# Altium schematic sheet OCB.SchDoc
size A; SheetNumber: 1; SheetTotal: 1
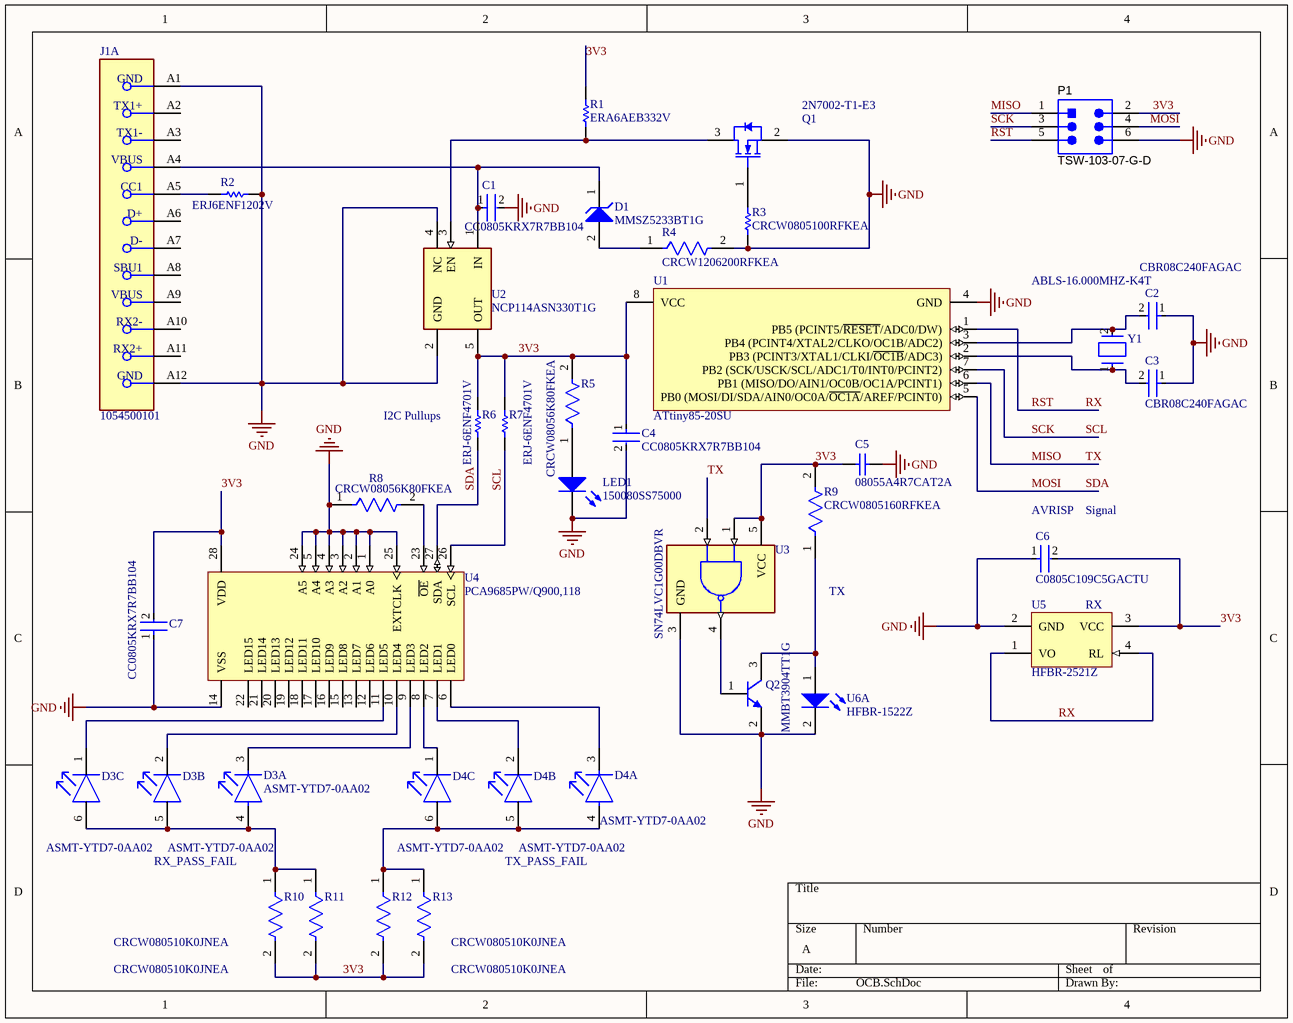
[diagram p0: OCB.SchDoc]

## Parts
C1  CC0805KRX7R7BB104  [FP-CC0805-0_85-MFG]
C2  CBR08C240FAGAC  [FP-CBR08C-MFG]
C3  CBR08C240FAGAC  [FP-CBR08C-MFG]
C4  CC0805KRX7R7BB104  [FP-CC0805-0_85-MFG]
C5  08055A4R7CAT2A  [CAPC2013X71X50ML20T25]
C6  C0805C109C5GACTU  [FP-C0805C-DN-MFG]
C7  CC0805KRX7R7BB104  [FP-CC0805-0_85-MFG]
D1  MMSZ5233BT1G  [ONSC-SOD-123-2-425-04_V]
D3  ASMT-YTD7-0AA02  [FP-PLCC-6-MFG]  (parts A,B,C of 3)
D4  ASMT-YTD7-0AA02  [FP-PLCC-6-MFG]  (parts A,B,C of 3)
J1  1054500101  [FP-1054500101-MFG]  (part A of 3)
LED1  150080SS75000  [0805_A]
P1  TSW-103-07-G-D  [SMTC-TSW-103-07-G-D_V]
Q1  2N7002-T1-E3  [VISH-TO-236-3_A_L]
Q2  MMBT3904TT1G  [ONSC-SC-75-3-463-01_V]
R1  ERA6AEB332V  [RESC2013X60X40NL20T25]
R2  ERJ6ENF1202V  [RESC2013X70X40ML20T20]
R3  CRCW0805100RFKEA  [RESC2013X50X30LL20T20]
R4  CRCW1206200RFKEA  [FP-CRCW1206-e3-IPC_C]
R5  CRCW08056K80FKEA  [FP-CRCW0805-e3-IPC_A]
R6  ERJ-6ENF4701V  [RESC2013X70X40NL20T20]
R7  ERJ-6ENF4701V  [RESC2013X70X40NL20T20]
R8  CRCW08056K80FKEA  [FP-CRCW0805-e3-IPC_A]
R9  CRCW0805160RFKEA  [FP-CRCW0805-e3-IPC_C]
R10  CRCW080510K0JNEA  [FP-CRCW0805-e3-IPC_C]
R11  CRCW080510K0JNEA  [FP-CRCW0805-e3-IPC_C]
R12  CRCW080510K0JNEA  [FP-CRCW0805-e3-IPC_C]
R13  CRCW080510K0JNEA  [FP-CRCW0805-e3-IPC_C]
U1  ATtiny85-20SU  [8S2_M]
U2  NCP114ASN330T1G  [FP-483-MFG]
U3  SN74LVC1G00DBVR  [FP-DBV0005A-MFG]
U4  PCA9685PW/Q900,118  [SOT361-1_V]
U5  HFBR-2521Z  [BCM-HFBR-2521Z-4]
U6  HFBR-1522Z  [AVAG-HFBR-15X2Z_V]  (part A of 2)
Y1  ABLS-16.000MHZ-K4T  [FP-ABLS-MFG]

## Nets
GND: C1.2 C2.1 C3.1 C4.2 C5.1 C6.1 C7.1 J1.A1(GND) J1.A12(GND) LED1.1(K) P1.6 Q1.2(S) Q2.2(E) R2.2 R3.1 R4.2 R8.1 U1.4(GND) U2.2(GND) U2.4(NC) U3.3(GND) U4.1(A0) U4.2(A1) U4.3(A2) U4.4(A3) U4.5(A4) U4.14(VSS) U4.24(A5) U4.25(EXTCLK) U5.2(GND) U6.2(CATHODE)
3V3: C4.1 C5.2 C6.2 C7.2 P1.2 R1.2 R5.2 R6.2 R7.2 R9.2 R10.2 R11.2 R12.2 R13.2 U1.8(VCC) U2.5(OUT) U3.1(A) U3.5(VCC) U4.28(VDD) U5.3(VCC)
MISO: P1.1 U1.6(PB1_(MISO/DO/AIN1/OC0B/OC1A/PCINT1)) U3.2(B)  [also labelled TX]
MOSI: P1.4 R6.1 U1.5(PB0_(MOSI/DI/SDA/AIN0/OC0A/~{OC1A}/AREF/PCINT0)) U4.27(SDA)  [also labelled SDA]
RST: P1.5 U1.1(PB5_(PCINT5/~{RESET}/ADC0/DW)) U5.1(VO) U5.4(RL)  [also labelled RX]
SCK: P1.3 R7.1 U1.7(PB2_(SCK/USCK/SCL/ADC1/T0/INT0/PCINT2)) U4.26(SCL)  [also labelled SCL]
NetC1_1: C1.1 D1.1(K) J1.A4(VBUS) U2.1(IN)
NetC2_2: C2.2 U1.3(PB4_(PCINT4/XTAL2/CLKO/OC1B/ADC2)) Y1.2
NetC3_2: C3.2 U1.2(PB3_(PCINT3/XTAL1/CLKI/~{OC1B}/ADC3)) Y1.1
NetD1_2: D1.2(A) R4.1
NetD3_1: D3.1(Cathode(Blue)) U4.11(LED5)
NetD3_2: D3.2(Cathode(Green)) U4.10(LED4)
NetD3_3: D3.3(Cathode(Red)) U4.9(LED3)
NetD3_4: D3.4(Anode(Red)) D3.5(Anode(Green)) D3.6(Anode(Blue)) R10.1 R11.1
NetD4_1: D4.1(Cathode(Blue)) U4.8(LED2)
NetD4_2: D4.2(Cathode(Green)) U4.7(LED1)
NetD4_3: D4.3(Cathode(Red)) U4.6(LED0)
NetD4_4: D4.4(Anode(Red)) D4.5(Anode(Green)) D4.6(Anode(Blue)) R12.1 R13.1
NetJ1_A5: J1.A5(CC1) R2.1
NetLED1_2: LED1.2(A) R5.1
NetQ1_1: Q1.1(G) R3.2
NetQ1_3: Q1.3(D) R1.1 U2.3(EN)
NetQ2_1: Q2.1(B) U3.4(Y)
NetQ2_3: Q2.3(C) R9.1 U6.1(ANODE)
NetR8_2: R8.2 U4.23(~{OE})

Not connected (* = marked no-connect by the designer): J1 A2(TX1+) A3(TX1-) A6(D+) A7(D-) A8(SBU1) A9(VBUS) A10(RX2-) A11(RX2+); U4 12(LED6) 13(LED7) 15(LED8) 16(LED9) 17(LED10) 18(LED11) 19(LED12) 20(LED13) 21(LED14) 22(LED15)

## Notes on the sheet
- (near R6) I2C Pullups
- (near C6) AVRISP
- (near C6) Signal
- TX
- (near U5) RX
- RX_PASS_FAIL
- TX_PASS_FAIL

## Library data of the parts
C1 C4 C7 = CMP-1036-04402-6: CAP CER 0.1UF 16V X7R 0805; Manufacturer: Yageo; Material: Ceramic; Tolerance: 0.1; Capacitance: 100 nF; Value: 100 nF; Manufacturer Part Number: CC0805KRX7R7BB104; Temperature: -30°C to +85°C; Lead Free: Yes; Footprint Url: http://www.yageo.com/exep/pages/download/literatures/UPY-C_GEN_24.pdf; Voltage Rating: 16 V; Package: CC0805-0.85; RoHS: TRUE; Digikey Description: CAP CER 0.1UF 16V X7R 0805; Category: Cap; Octopart: https://octopart.com/cc0805krx7r7bb104-yageo-39467769; Device Class L3: Ceramic Capacitors; ComponentLink2URL: http://www.yageo.com/documents/recent/UPY-GPHC_Y5V_6.3V-to-50V_8.pdf; Temperature Range Low: -30°C; Mouser Description: Multilayer Ceramic Capacitors MLCC - SMD/SMT 100nF 16V X7R 10%; Automotive: No; Device Class L2: Capacitors; Height: 0.95mm; ComponentLink2Description: Datasheet; Temperature Characteristic: X7R; Ipc Land Pattern Name: CAPC200125X85; Device Class L1: Passive Components; Temperature Range High: +85°C
C2 C3 = CMP-03020-025790-1: CAP CER 24PF 250V C0G/NP0 0805; Manufacturer: KEMET; Material: Ceramic; Description: CBR0805 24 pF C0G 30ppm/°C 1.00% 250 V; Temperature Characteristic: C0G; Tolerance: 0.01; Temperature Coefficient: 30ppm/°C; Ipc Land Pattern Name: CAPC200125X85; Device Class L1: Passive Components; Manufacturer Part Number: CBR08C240FAGAC; Temperature Range High: +125°C; ComponentLink2Description: Datasheet; Package: CBR08C; Device Class L2: Capacitors; Octopart: https://octopart.com/cbr08c240fagac-kemet-23843296; RoHS: TRUE; Lead Free: Yes; Voltage Rating: 250 V; Automotive: No; Height: 0.95mm; Category: Cap; Digikey Description: CAP CER 24PF 250V C0G/NP0 0805; Device Class L3: Ceramic Capacitors; Value: 24 pF; Capacitance: 24 pF; ComponentLink2URL: https://content.kemet.com/datasheets/KEM_C1030_CBR_SMD.pdf; Temperature Range Low: -55°C; Temperature: -55°C to +125°C
C5 = CMP-1036-00549-2: Manufacturer: AVX Interconnect / Elco; Part Number: 08055A4R7CAT2A
C6 = CMP-2007-00453-2: CAP CER 1PF 50V C0G/NP0 0805; Manufacturer: KEMET; Value: 1.0 pF; Temperature Characteristic: C0G; Material: Ceramic; Tolerance: 0.25 pF; Temperature Coefficient: 30ppm/°C; Manufacturer Part Number: C0805C109C5GACTU; Voltage Rating: 50 V; Device Class L2: Capacitors; Ipc Land Pattern Name: CAPC200125X78; Device Class L3: Ceramic Capacitors; Lead Free: Yes; ComponentLink2Description: Datasheet; Digikey Description: CAP CER 1PF 50V C0G/NP0 0805; Temperature Range High: +125°C; Temperature: -55°C to +125°C; Temperature Range Low: -55°C; Package: C0805C-DN; ComponentLink2URL: https://content.kemet.com/datasheets/KEM_C1003_C0G_SMD.pdf; Height: 0.88mm; Automotive: No; Mouser Description: Multilayer Ceramic Capacitors MLCC - SMD/SMT 50volts 1.0pF C0G 0.25%; Category: Cap; Octopart: https://octopart.com/c0805c109c5gactu-kemet-130858; Capacitance: 1.0 pF; RoHS: TRUE; Device Class L1: Passive Components
D1 = CMP-1060-00590-1: Zener Voltage Regulator, 500 mW, 2-Pin SOD-123, Pb-Free, Tape and Reel; Manufacturer: On Semiconductor; VZ Typ (V): 6.0; P Max (W): 0.5; PackageReference: SOD-123-2-425-04; ComponentLink3URL: http://www.onsemi.com/pub_link/Collateral/425-04.PDF; DatasheetVersion: Rev. 12; PackageDescription: 2-Pin SOD, Body 1.6 x 2.69 mm; ComponentLink2URL: http://www.onsemi.com/pub_link/Collateral/MMSZ5221BT1-D.PDF; ComponentLink1URL: http://www.onsemi.com/; Mounting Technology: Surface Mount; PartNumber: MMSZ5233BT1G; ComponentLink3Description: Package Specification; ComponentLink2Description: Datasheet; ComponentLink1Description: Manufacturer URL; RoHS: Pb-Free; Packing: Tape and Reel; PackageVersion: Rev. G, 10/2009
D3 D4 = CMP-18399-000005-1: LED RGB DIFFUSED 6PLCC SMD; Manufacturer: Broadcom; Power Dissipation: 125/90/90mW; Colour: Red, Green, Blue; Led Orientation: Top View; Max Junction Temp: +110°C; Forward Current: 20mA; Wavelength: 623/529/469nm; Viewing Angle: 120°; Forward Voltage: 2.1/3.1/3.1V; Reverse Voltage: 4V; Luminous Intensity: 650/1900/384mcd; Peak Emmision Wavelength: 630/522/465nm; Height: 2mm; Temperature: -40°C to +100°C; ComponentLink2URL: https://docs.broadcom.com/doc/AV02-3873EN; Temperature Range High: +100°C; RoHS: TRUE; Device Class L3: unset; ComponentLink2Description: Datasheet; Automotive: No; Temperature Range Low: -40°C; Device Class L1: Optoelectronics; Manufacturer Part Number: ASMT-YTD7-0AA02; Octopart: https://octopart.com/asmt-ytd7-0aa02-broadcom-71127359; Category: Diode; Package: PLCC-6; Lead Free: Yes; Device Class L2: LEDs; Digikey Description: LED RGB DIFFUSED 6PLCC SMD; Mouser Description: Standard LEDs - SMD PLCC6,T/MT SILICONE RGB
J1 = CMP-04767-000004-1: CONN RCP USB3.1 TYPEC 24P SMD RA; Manufacturer: Molex; Number Of Contacts: 24; Voltage Rating: 30V; Shielding: true; Is Female: yes; Current Rating: 0.25/1.25/5A; Pitch: 0.5mm; Conn Orientation: Right Angle; Package: 0; Height: 3.44mm; Footprint Url: https://www.molex.com/pdm_docs/sd/1054500101_sd.pdf; Device Class L1: Connectors; Category: Conn; Device Class L2: USB Connectors; Digikey Description: CONN RCP USB3.1 TYPEC 24P SMD RA; Contact Material: Gold,Nickel; Mouser Description: USB Shielded I/O Receptacle; Type C; Right Angle; Surface Mount; Gold over Nickel; ComponentLink2Description: Datasheet; Lead Free: Yes; Automotive: No; Temperature Range High: +85°C; RoHS: TRUE; Octopart: https://octopart.com/105450-0101-molex-68082325; ComponentLink2URL: https://www.molex.com/webdocs/datasheets/pdf/en-us/1054500101_IO_CONNECTORS.pdf; Temperature: -30°C to +85°C; Usb Standard: USB 3.1; Temperature Range Low: -30°C; Device Class L3: unset; Manufacturer Part Number: 1054500101
LED1 = CMP-1426-00010-1: SMD mono-color Chip LED, WL-SMCW, Super Red; Manufacturer: Wuerth Elektronik; PackageReference: 0805_A; ComponentLink2URL: http://katalog.we-online.com/led/datasheet/150080SS75000.pdf; ComponentLink1URL: http://www.we-online.com; Color: Super Red; ComponentLink2Description: Datasheet; ComponentLink1Description: Manufacturer URL; PartNumber: 150080SS75000
P1 = CMP-2000-07329-1: Through Hole Header, Pitch 2.54 mm, 2 x 3 Position, Height 8.58 mm, Tail Length 2.54 mm, -55 to 125 degC, RoHS, Bulk; Manufacturer: Samtec-Inc.; Number of Positions Loaded: All; Number of Positions: 6; Row Spacing: 0.100"(2.54mm); Connector Type: Header,Unshrouded; Package Reference: TSW-103-07-G-D; Termination: Solder; Manufacturer URL: http://www.samtec.com/; Contact Finish: Gold; Contact Mating Length: 0.230"(5.84mm); Package Description: Through Hole Header, Pitch 2.54 mm, 2 x 3 Position, Height 8.58 mm, Tail Length 2.54 mm; Datasheet Version: 12/2015; Number of Rows: 2; Features: -; Family: RectangularConnectors-Headers,MalePins; Fastening Type: -; Datasheet URL: http://suddendocs.samtec.com/catalog_english/tsw_th.pdf; Category: Connectors,Interconnects; Package URL: http://suddendocs.samtec.com/prints/tsw-xxx-xx-xxx-x-xx-xxx-mkt.pdf; Mounting Type: ThroughHole; Contact Finish Thickness: 10µin(0.25µm); Packaging: Bulk; Color: Black; Pitch: 0.100"(2.54mm); Series: TSW; Contact Type: MalePin; Mounting Technology: ThroughHole
Q1 = CMP-2000-05565-1: N-Channel MOSFET, 115 mA, 60 V, -55 to 150 degC, 3-Pin SOT23, RoHS, Tape and Reel; Manufacturer: Vishay; Continuous Drain Current Id: 115mA; Threshold Voltage Vgs: 2.1V; Transistor Case Style: TO-236; On Resistance Rds(on): 7.5ohm; Transistor Polarity: NChannel; Power Dissipation Pd: 200mW; No. of Pins: 3; SVHC: NoSVHC(17-Dec-2014); Drain Source Voltage Vds: 60V; Rds(on) Test Voltage Vgs: 10V; Package URL: http://www.vishay.com/docs/71196/71196.pdf; Package Description: 3-Pin Small Outline Transistor, Body 2.92 x 1.3 mm, Pitch 0.95 mm; Datasheet URL: http://www.vishay.com/docs/70226/70226.pdf; Package Reference: TO-236-3; MSL: MSL1-Unlimited; Mounting Technology: SurfaceMount; Operating Temperature Max: 150°C; Datasheet Version: Rev. F, 07/2001; Manufacturer URL: http://www.vishay.com/
Q2 = CMP-1048-00420-1: General Purpose Transistor, NPN Silicon, 3-Pin SC-75, Pb-Free, Tape and Reel; Manufacturer: On Semiconductor; IC Continuous (A): 0.2; fT Min (MHz): 300; ComponentLink3URL: http://www.onsemi.com/pub_link/Collateral/463-01.PDF; DatasheetVersion: Rev. 5; RoHS: TRUE; Mounting Technology: Surface Mount; ComponentLink1URL: http://www.onsemi.com/; ComponentLink3Description: Package Specification; PackageReference: SC-75-3-463-01; Polarity: NPN; ComponentLink2Description: Datasheet; PackageVersion: Rev. F, 07/2005; PartNumber: MMBT3904TT1G; ComponentLink2URL: http://www.onsemi.cn/pub_link/Collateral/MMBT3904TT1-D.PDF; ComponentLink1Description: Manufacturer URL; PackageDescription: 3-Pin Small Outline Transistor, Body 1.6 x 0.8 mm, Pitch 0.5 mm; Packing: Tape and Reel
R1 = CMP-2001-00629-1: Manufacturer: Panasonic; Part Number: ERA6AEB332V
R2 = CMP-2001-00513-1: Manufacturer: Panasonic; Part Number: ERJ6ENF1202V
R3 = CMP-2001-04901-1: Manufacturer: Vishay Dale; Part Number: CRCW0805100RFKEA
R4 = CMP-2003-01935-2: RES Thick Film, 200Ω, 1%, 0.25W, 100ppm/°C, 1206; Max Power Dissipation: 250mW; Voltage Rating (DC): 200V; Resistance: 200R; Min Operating Temperature: -55°C; Length: 3.2mm; Composition: Thick Film; Number of Terminations: 2; Power Rating: 250mW; Temperature Coefficient: 100ppm/°C; Lead Free: Lead Free; Voltage Rating: 200V; Case Code (Metric): 3216; Features: Automotive AEC-Q200; Max Operating Temperature: 155°C; Height: 0.55mm; Case/Package: 1206; Contact Plating: Tin; Package Quantity: 10; Width: 1.6mm; Military Standard: Not; Number of Pins: 2; Weight: 0.000353oz; Working Voltage: 200V; Packaging: Tape and Reel; Depth: 1.6mm; Case Code (Imperial): 1206; Termination: SMD/SMT; Radiation Hardening: No; Tolerance: 1%
R5 R8 = CMP-2001-04088-2: RES Thick Film, 6.8kΩ, 1%, 0.125W, 100ppm/°C, 0805; Resistance: 6.8kR; Voltage Rating: 150V; Max Power Dissipation: 125mW; Termination: SMD/SMT; Number of Terminations: 2; Radiation Hardening: No; Lead Free: Lead Free; Features: Automotive AEC-Q200; Case Code (Metric): 2012; Contact Plating: Tin; Temperature Coefficient: 100ppm/°C; Tolerance: 1%; Min Operating Temperature: -55°C; Width: 0.049inch; Mount: Surface Mount; Weight: 0.000194oz; Max Operating Temperature: 155°C; Case Code (Imperial): 0805; Military Standard: Not; Depth: 1.25mm; Length: 2mm; Height: 0.45mm; Voltage Rating (DC): 150V; Case/Package: 0805; Package Quantity: 10; Packaging: Tape and Reel; Composition: Thick Film; Power Rating: 125mW
R6 R7 = CMP-2001-00550-5: Chip Resistor, 4.7 KOhm, +/- 1%, 0.125 W, -55 to 155 degC, 0805 (2012 Metric), RoHS, Tape and Reel; Manufacturer: Panasonic; Voltage Rating: 150 V; Min Operating Temperature: -55 degC; PackageReference: 0805; Mounting Technology: Surface Mount; Height: 0.6 mm; PackageDescription: 2-Pin Surface Mount Device, Body 2 x 1.25 mm; RoHSCompliant: true; Length: 2 mm; REACH SVHC: Yes; Packaging: Tape and Reel; Pins: 2; Mount: Surface Mount; ComponentLink2Description: Datasheet; ComponentLink1URL: http://www.panasonic.com/; ComponentLink1Description: Manufacturer URL; DatasheetVersion: 04/2015; Package Quantity: 5000; ComponentLink2URL: http://industrial.panasonic.com/cdbs/www-data/pdf/RDA0000/AOA0000C86.pdf; Max Operating Temperature: 155 degC
R9 = CMP-1013-00418-2: RES Thick Film, 160Ω, 1%, 0.125W, 100ppm/°C, 0805; Voltage Rating (DC): 150V; Max Power Dissipation: 125mW; Resistance: 160R; Termination: SMD/SMT; Min Operating Temperature: -55°C; Number of Terminations: 2; Number of Pins: 2; Composition: Thick Film; Voltage Rating: 150V; Length: 2mm; Tolerance: 1%; Case Code (Metric): 2012; Case/Package: 0805; Width: 0.049inch; Packaging: Tape and Reel; Temperature Coefficient: 100ppm/°C; Power Rating: 125mW; Max Operating Temperature: 155°C; Military Standard: Not; Lead Free: Lead Free; Features: Automotive AEC-Q200; Height: 0.02inch; Package Quantity: 10; Depth: 1.25mm; Case Code (Imperial): 0805; Weight: 0.000194oz
R10-R13 = CMP-2001-04910-2: RES Thick Film, 10kΩ, 5%, 0.125W, 200ppm/°C, 0805; Voltage Rating: 150V; Resistance: 10kR; Power Rating: 125mW; Composition: Thick Film; Termination: SMD/SMT; Case Code (Imperial): 0805; Temperature Coefficient: 200ppm/°C; Contact Plating: Tin; Tolerance: 5%; Military Standard: Not; Height: 0.45mm; Weight: 0.000194oz; Length: 2mm; Packaging: Tape and Reel; Mount: Surface Mount; Width: 1.25mm; Depth: 1.25mm; Voltage Rating (DC): 150V; Lead Free: Lead Free; Case/Package: 0805; Radiation Hardening: No; Max Operating Temperature: 155°C; Min Operating Temperature: -55°C; Case Code (Metric): 2012; Package Quantity: 5000
U1 = CMP-0093-00173-2: 8-bit AVR Microcontroller, 20MHz, 2.7-5.5V, 8K Flash, 512 Bytes EEPROM, 512 Bytes SRAM, Industrial Grade (-40°C to 85°C), 8-Lead SOIC, Pb-Free; ComponentLink3Description: ATtiny25/45/85 Summary; DatasheetVersion: revN, Apr-2011; PackageVersion: revF, Apr-2008; ComponentLink3URL: http://www.atmel.com/dyn/resources/prod_documents/2586S.pdf; ComponentLink1URL: http://www.atmel.com/; ComponentLink2Description: ATtiny25/45/85 Datasheet; RevisionNote: DatasheetVersion updated. URLs added.; PackageDescription: 8-Lead, 0.208" Body, Plastic Small Outline Package (EIAJ); ComponentLink1Description: Manufacturer URL; PackageReference: 8S2; ComponentLink2URL: http://www.atmel.com/dyn/resources/prod_documents/doc2586.pdf
U2 = CMP-07128-000001-1: IC REG LINEAR 3.3V 300MA 5TSOP; Manufacturer: ON Semiconductor; Dropout Voltage: 150mV; Number Of Outputs: 1; Output Type: Fixed; Standoff Height: 0.01mm; Nominal Supply Current: 50uA; Accuracy Percentage: 1%; Max Junction Temp: +150°C; Min Supply Voltage: 1.7V; Max Supply Voltage: 5.5V; Output Voltage: 3.3V; Device Class L2: Power Management ICs; Digikey Description: IC REG LINEAR 3.3V 300MA 5TSOP; Footprint Url: https://www.onsemi.com/pub/Collateral/483.PDF; Temperature: to +150°C; RoHS: TRUE; Octopart: https://octopart.com/ncp114asn330t1g-on+semiconductor-74628742; Package: 483; Height: 1.1mm; Device Class L1: Integrated Circuits (ICs); Device Class L3: Voltage Regulators - Linear; ComponentLink2URL: https://www.onsemi.com/pub/Collateral/NCP114-D.PDF; Output Current: 300mA; Automotive: No; ComponentLink2Description: Datasheet; Manufacturer Part Number: NCP114ASN330T1G; Category: IC; Lead Free: Yes; Temperature Range High: +150°C
U3 = CMP-0859-00113-4: IC GATE NAND 1CH 2-INP SOT23-5; Manufacturer: Texas Instruments; Logic Function Desc: Inverting; Number Of Circuits: 1; Nominal Supply Current: 10uA; Max Supply Voltage: 5.5V; Standoff Height: 0mm; Frequency: 100MHz; Propagation Delay: 4.3ns; Min Supply Voltage: 1.65V; Number Of Inputs: 2; Digikey Description: IC GATE NAND 1CH 2-INP SOT23-5; Ipc Land Pattern Name: SOT95P280X145-5; Automotive: No; RoHS: TRUE; Mouser Description: IC Mos 74LVC1G00/SO/SN74LVC1G00DBVR TEXAS INSTRUMENT RoHS LVC SOt23; Package: DBV0005A; ComponentLink2URL: http://www.ti.com/lit/ds/symlink/sn74lvc1g00.pdf; Device Class L2: Logic ICs; Ambient Temperature Range Low: -40°C; Temperature Range Low: -40°C; Ambient Temperature Range High: +125°C; Device Class L1: Integrated Circuits (ICs); Height: 1.45mm; Octopart: https://octopart.com/sn74lvc1g00dbvr-texas+instruments-465560; Temperature: -40°C to +125°C; Temperature Range High: +125°C; Category: IC; ComponentLink2Description: Datasheet; Number Of Outputs: 1; Device Class L3: Logic Gates; Manufacturer Part Number: SN74LVC1G00DBVR; Lead Free: Yes
U4 = CMP-1595-00002-2: 16-Channel, 12-Bit PWM Fm+ I2C-Bus LED Controller, 2.3 to 5.5 V, -40 to 85 degC, 28-Pin TSSOP (SOT361-1), RoHS, Tape and Reel; Supply Voltage Max: 5.5 V; Supply Current Max: 10 mA; Supply Voltage Min: 2.3 V; Frequency: 25000000 Hz; ComponentLink1Description: Manufacturer URL; PackageVersion: 02/2003; PackageDescription: 28-Pin Small Outline Package, Body 9.7 x 4.4 mm, Pitch 0.65 mm; Packing: Tape and Reel; ComponentLink2URL: http://www.nxp.com/documents/data_sheet/PCA9685.pdf; ComponentLink1URL: http://www.nxp.com/; Mounting Technology: Surface Mount; PartNumber: PCA9685; ComponentLink2Description: Datasheet; Temperature Min: -40 degC; ComponentLink3URL: http://www.nxp.com/documents/outline_drawing/sot361-1_po.pdf; Temperature Max: 85 degC; DatasheetVersion: Rev. 4; ComponentLink3Description: Package Specification; RoHS: TRUE; Code_JEDEC: MO-153
U5 = CMP-2000-05068-1: The Versatile Fiber Optic Connection, 5 MBd, -40 to 85 degC, 4-Pin, RoHS, Rail/Tube; Manufacturer: Broadcom; Peak Wavelength: 600nm; Maximum Data Rate: 5MBd; Maximum Power Dissipation: 40mW; Maximum Output Current: 25mA; Maximum Operating Supply Voltage: 7V; Typical Operating Supply Voltage: 1.8V; Product Height: 7.6mm; Product Width: 12.2mm; Minimum Operating Supply Voltage: -0.5V; Pin_Count: 6; Product Length: 18.8mm; Connector Type: Round; Maximum Operating Temperature: 85C; Type: RX; Family: HFBR-2521; Manufacturer URL: http://www.broadcom.com/; Product Type: OpticalFiber; Minimum Operating Temperature: -40C; Package URL: http://docs.avagotech.com/docs/AV02-1501EN; Datasheet Version: Sep-14; Mounting: ThroughHole; Datasheet URL: http://docs.avagotech.com/docs/AV02-1501EN
U6 = CMP-2000-06401-1: The Versatile Fiber Optic Connection, 5 V, -40 to 85 degC, 6-Pin THD, RoHS, Tube; Manufacturer: Avago; Current - DC Forward (If) (Max): 80mA; Online Catalog: HFBR-15xxZ; Other Names: 516-2044HFBR1522Z; Voltage - Forward (Vf) (Typ): 2.02V; Capacitance: 86pF; Wavelength: 660nm; Voltage - DC Reverse (Vr) (Max): 5V; Connector Type: VersatileLink; PCN Design/Specification: Mold/Design29/Jul/2011Lead-FrameUpdates09/Jun/2015Lead-FrameUpdate09/Jun/2015; Series: -; Datasheet URL: http://www.avagotech.com/docs/AV02-1501EN; Category: Optoelectronics; Standard Package: 200; Datasheet Version: 09/2014; Spectral Bandwidth: -; Package Reference: HFBR-15X2Z; Package Description: 6-Pin Through Hole Device, Body 18.8 x 12.19 mm, Pitch 2.54 mm; Mounting Technology: ThroughHole; Manufacturer URL: http://www.avagotech.com/; Family: FiberOptics-Transmitters-Discrete
Y1 = CMP-27762-000003-1: CRYSTAL 16.0000MHZ 18PF SMD; Manufacturer: Abracon; Frequency: 16MHz; Stability: 50ppm; Tolerance: 30ppm; Standoff Height: 0mm; Esr: 40Ω; ComponentLink2URL: https://abracon.com/Resonators/abls.pdf; Temperature Range High: +125°C; Package: ABLS; Device Class L3: Crystals; Temperature: -40°C to +125°C; Load Capacitance: 18pF; Device Class L2: Crystals / Oscillators; Mouser Description: Crystal 16MHz ±30ppm (Tol) ±50ppm (Stability) 18pF FUND 40Ohm 2-Pin HC-49/US SMD T/R; Category: Crys; ComponentLink2Description: Datasheet; Manufacturer Part Number: ABLS-16.000MHZ-K4T; Series: ABLS; Automotive: No; Octopart: https://octopart.com/abls-16.000mhz-k4t-abracon-18618626; RoHS: TRUE; Digikey Description: CRYSTAL 16.0000MHZ 18PF SMD; Temperature Range Low: -40°C; Lead Free: Yes; Height: 4.3mm; Device Class L1: Passive Components